# Altium schematic sheet Sheet1.SchDoc
size A3; SheetNumber: 2; SheetTotal: 2
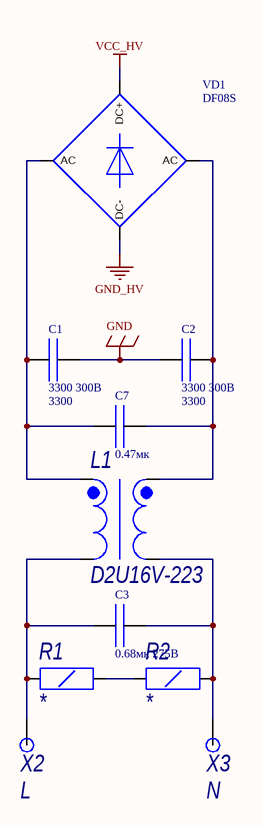
[diagram p0: Sheet1.SchDoc]

## Parts
C1  3300 300В  value 3300  [HVCerCap_d7.5x10]
C2  3300 300В  value 3300  [HVCerCap_d7.5x10]
C3  0.68мк 275В  [FILM_P1500L1800W1100H1400PD80]
C7  value 0.47мк  [CAP23X9X19mm]  (hidden comment: 0.47мк 630В)
L1  D2U16V-223  [UU16]
R1  *  [R-1206]
R2  *  [R-1206]
VD1  DF08S  [SDIP 4L]
X2  L  [PAD_TOP_10x10]  (net tie, no BOM)
X3  N  [PAD_TOP_10x10]  (net tie, no BOM)

## Nets
GND: C1.2 C2.1
GND_HV: VD1.DC-
VCC_HV: VD1.DC+
NetC1_1: C1.1 C7.1 L1.4(S2) VD1.AC2(AC)
NetC2_2: C2.2 C7.2 L1.2(S1) VD1.AC1(AC)
NetC3_1: C3.1 L1.3(E2) R1.1 X2.1
NetC3_2: C3.2 L1.1(E1) R2.2 X3.1
NetR1_2: R1.2 R2.1

## Library data of the parts
C1 C2 = HVCerCap_d7.5X10: Конденсатор керамический; Dielectric: Y2; Voltage: 300В; ComponentDescription: =ComponentType+', '+Value+', '+Voltage+', '+Dielectric+', '+Package; ComponentType: Конденсатор керамический; Package: HVCerCap_d7.5x10
C3 = FILM_CAP: Конденсатор пленочный; Dielectric: X2; Voltage: 275В; ComponentDescription: =ComponentType+', '+Value+', '+Voltage+', '+Dielectric+', '+Package; ComponentType: Конденсатор пленочный; Package: FILM_P1500L1800W1100H1400PD80; Value: 0.68мк
C7 = CBB22 0.47uF 630V: Конденсатор металло-плёночный; Dielectric: СВВ22; Voltage: 630В; ComponentDescription: =ComponentType+', '+Value+', '+Voltage+', '+Dielectric+', '+Package; ComponentType: Конденсатор металло-плёночный; Package: CAP23X9X19mm
L1 = D2U16V-223: Дроссель синфазный; ComponentDescription: =ComponentTypе+', '+Comment+', '+Package; ComponentTypе: Дроссель синфазный; Package: UU16
R1 R2 = R1206: Резистор SMD; Tolerance: 5%; ComponentDescription: =ComponentType+', '+ Package +', '+Value+'Ом, ' + Tolerance; ComponentType: Резистор SMD; Package: R-1206; Value: *
VD1 = DF08S: Диодный мост, однофазный; pin to pad: AC1>1 AC2>2 DC+>3 DC->4; ComponentType: Диодный мост, однофазный; Package: SDIP 4L; ComponentDescription: =ComponentType+', '+Comment+', '+Package
X2 X3 = PAD: Контакт